# Altium project SFPP.PrjPCB (part 2 of 2)
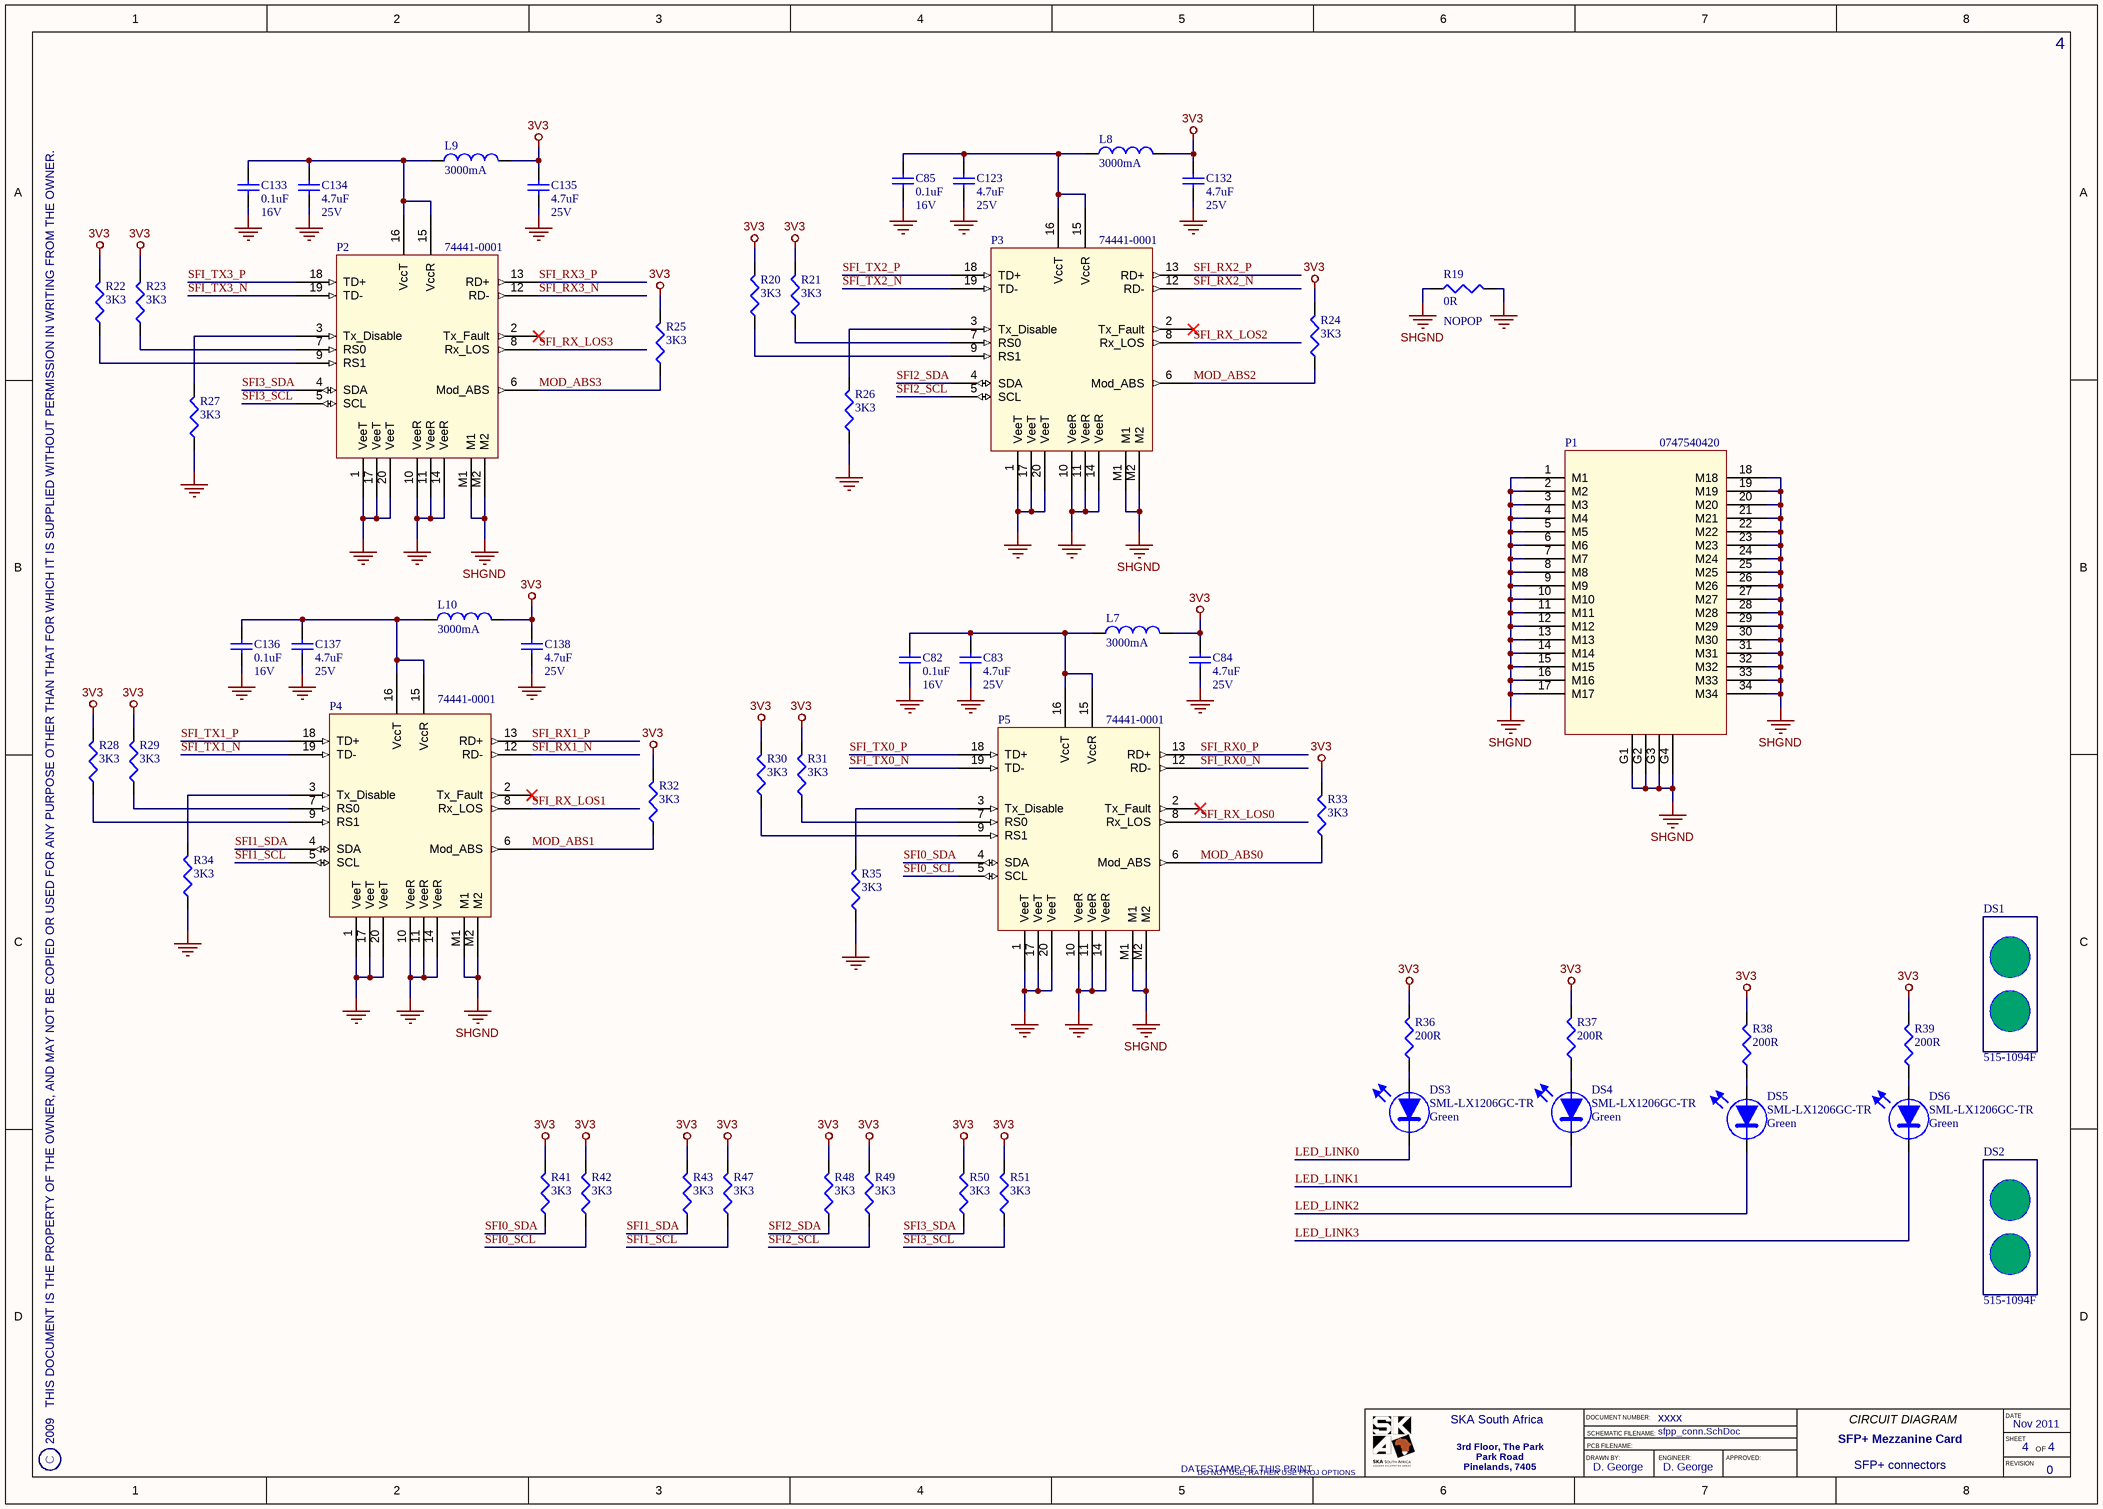
[diagram p4: sfpp_conn.SchDoc]

## Nets that join several sheets
1V2_0: mezzanine (7 pins), phy0 (10 pins)
1V2_1: mezzanine (7 pins), phy1 (10 pins)
1V5: mezzanine (24 pins), phy0 (C60.2 U1.C7), phy1 (C91.2 U2.C7)
1V8: mezzanine (7 pins), phy0 (C47.2 L2.1), phy1 (C94.2 L5.1)
2V5: mezzanine (7 pins), phy1 (C141.2 L11.1 U8.6)
3V3: mezzanine (42 pins), phy0 (7 pins), phy1 (14 pins), sfpp_conn (32 pins)
GND: mezzanine (153 pins), phy0 (122 pins), phy1 (118 pins), sfpp_conn (41 pins)
LED_LINK0: phy0 (U1.D5), sfpp_conn (DS3.1)
LED_LINK1: phy0 (U1.K5), sfpp_conn (DS4.1)
LED_LINK2: phy1 (U2.D5), sfpp_conn (DS5.1)
LED_LINK3: phy1 (U2.K5), sfpp_conn (DS6.1)
MDIO_MODE_EN: mezzanine (J1.C17 R11.2), phy0 (Q4.1)
MGT_RX_N0: mezzanine (J1.A7), phy0 (U1.B3)
MGT_RX_N1: mezzanine (J1.A5), phy0 (U1.B4)
MGT_RX_N2: mezzanine (J1.A3), phy0 (U1.B5)
MGT_RX_N3: mezzanine (J1.A1), phy0 (U1.B6)
MGT_RX_N4: mezzanine (J1.A15), phy0 (U1.L2)
MGT_RX_N5: mezzanine (J1.A13), phy0 (U1.K2)
MGT_RX_N6: mezzanine (J1.A11), phy0 (U1.J2)
MGT_RX_N7: mezzanine (J1.A9), phy0 (U1.H2)
MGT_RX_N8: mezzanine (J1.B7), phy1 (U2.B3)
MGT_RX_N9: mezzanine (J1.B5), phy1 (U2.B4)
MGT_RX_N10: mezzanine (J1.B3), phy1 (U2.B5)
MGT_RX_N11: mezzanine (J1.B1), phy1 (U2.B6)
MGT_RX_N12: mezzanine (J1.B15), phy1 (U2.L2)
MGT_RX_N13: mezzanine (J1.B13), phy1 (U2.K2)
MGT_RX_N14: mezzanine (J1.B11), phy1 (U2.J2)
MGT_RX_N15: mezzanine (J1.B9), phy1 (U2.H2)
MGT_RX_P0: mezzanine (J1.A8), phy0 (U1.A3)
MGT_RX_P1: mezzanine (J1.A6), phy0 (U1.A4)
MGT_RX_P2: mezzanine (J1.A4), phy0 (U1.A5)
MGT_RX_P3: mezzanine (J1.A2), phy0 (U1.A6)
MGT_RX_P4: mezzanine (J1.A16), phy0 (U1.L1)
MGT_RX_P5: mezzanine (J1.A14), phy0 (U1.K1)
MGT_RX_P6: mezzanine (J1.A12), phy0 (U1.J1)
MGT_RX_P7: mezzanine (J1.A10), phy0 (U1.H1)
MGT_RX_P8: mezzanine (J1.B8), phy1 (U2.A3)
MGT_RX_P9: mezzanine (J1.B6), phy1 (U2.A4)
MGT_RX_P10: mezzanine (J1.B4), phy1 (U2.A5)
MGT_RX_P11: mezzanine (J1.B2), phy1 (U2.A6)
MGT_RX_P12: mezzanine (J1.B16), phy1 (U2.L1)
MGT_RX_P13: mezzanine (J1.B14), phy1 (U2.K1)
MGT_RX_P14: mezzanine (J1.B12), phy1 (U2.J1)
MGT_RX_P15: mezzanine (J1.B10), phy1 (U2.H1)
MGT_TX_N0: mezzanine (J1.A23), phy0 (C7.2)
MGT_TX_N1: mezzanine (J1.A21), phy0 (C5.2)
MGT_TX_N2: mezzanine (J1.A19), phy0 (C3.2)
MGT_TX_N3: mezzanine (J1.A17), phy0 (C1.2)
MGT_TX_N4: mezzanine (J1.A31), phy0 (C15.2)
MGT_TX_N5: mezzanine (J1.A29), phy0 (C13.2)
MGT_TX_N6: mezzanine (J1.A27), phy0 (C11.2)
MGT_TX_N7: mezzanine (J1.A25), phy0 (C9.2)
MGT_TX_N8: mezzanine (J1.B23), phy1 (C23.2)
MGT_TX_N9: mezzanine (J1.B21), phy1 (C21.2)
MGT_TX_N10: mezzanine (J1.B19), phy1 (C19.2)
MGT_TX_N11: mezzanine (J1.B17), phy1 (C17.2)
MGT_TX_N12: mezzanine (J1.B31), phy1 (C31.2)
MGT_TX_N13: mezzanine (J1.B29), phy1 (C29.2)
MGT_TX_N14: mezzanine (J1.B27), phy1 (C27.2)
MGT_TX_N15: mezzanine (J1.B25), phy1 (C25.2)
MGT_TX_P0: mezzanine (J1.A24), phy0 (C8.2)
MGT_TX_P1: mezzanine (J1.A22), phy0 (C6.2)
MGT_TX_P2: mezzanine (J1.A20), phy0 (C4.2)
MGT_TX_P3: mezzanine (J1.A18), phy0 (C2.2)
MGT_TX_P4: mezzanine (J1.A32), phy0 (C16.2)
MGT_TX_P5: mezzanine (J1.A30), phy0 (C14.2)
MGT_TX_P6: mezzanine (J1.A28), phy0 (C12.2)
MGT_TX_P7: mezzanine (J1.A26), phy0 (C10.2)
MGT_TX_P8: mezzanine (J1.B24), phy1 (C24.2)
MGT_TX_P9: mezzanine (J1.B22), phy1 (C22.2)
MGT_TX_P10: mezzanine (J1.B20), phy1 (C20.2)
MGT_TX_P11: mezzanine (J1.B18), phy1 (C18.2)
MGT_TX_P12: mezzanine (J1.B32), phy1 (C32.2)
MGT_TX_P13: mezzanine (J1.B30), phy1 (C30.2)
MGT_TX_P14: mezzanine (J1.B28), phy1 (C28.2)
MGT_TX_P15: mezzanine (J1.B26), phy1 (C26.2)
MOD_ABS0: phy0 (U1.D4), sfpp_conn (P5.6 R33.1)
MOD_ABS1: phy0 (U1.L4), sfpp_conn (P4.6 R32.1)
MOD_ABS2: phy1 (U2.D4), sfpp_conn (P3.6 R24.1)
MOD_ABS3: phy1 (U2.L4), sfpp_conn (P2.6 R25.1)
PHY0_RESET: mezzanine (J1.C18 R10.2), phy0 (Q1.1)
PHY0_SCL: mezzanine (P6.5), phy0 (U1.E9 U5.6)
PHY0_SDA: mezzanine (P6.6), phy0 (U1.D9 U5.5)
PHY0_SLV_SCL: mezzanine (P6.14), phy0 (U1.E5)
PHY0_SLV_SDA: mezzanine (P6.13), phy0 (U1.E4)
PHY1_RESET: mezzanine (J1.C19 R9.2), phy1 (Q5.1)
PHY1_SCL: mezzanine (P6.1), phy1 (U2.E9 U7.6)
PHY1_SDA: mezzanine (P6.2), phy1 (U2.D9 U7.5)
PHY1_SLV_SCL: mezzanine (P6.10), phy1 (U2.E5)
PHY1_SLV_SDA: mezzanine (P6.9), phy1 (U2.E4)
PHY_MDC: mezzanine (J1.C20 R7.1), phy0 (U1.D7), phy1 (U2.D7)
PHY_MDIO: mezzanine (J1.C21 R8.1), phy0 (U1.E7), phy1 (U2.E7)
PHY_MODE0: phy0 (Q4.3 R14.1 U1.K11), phy1 (U2.K11)
PHY_MODE1: phy0 (R18.2 U1.M9), phy1 (U2.M9)
PHY_MODE2: phy0 (R15.1 U1.L10), phy1 (U2.L10)
PHY_TRSTn: phy0 (R13.2 U1.K10), phy1 (U2.K10)
SFI0_SCL: phy0 (U1.F5), sfpp_conn (P5.5 R42.1)
SFI0_SDA: phy0 (U1.F4), sfpp_conn (P5.4 R41.1)
SFI1_SCL: phy0 (U1.L6), sfpp_conn (P4.5 R47.1)
SFI1_SDA: phy0 (U1.L5), sfpp_conn (P4.4 R43.1)
SFI2_SCL: phy1 (U2.F5), sfpp_conn (P3.5 R49.1)
SFI2_SDA: phy1 (U2.F4), sfpp_conn (P3.4 R48.1)
SFI3_SCL: phy1 (U2.L6), sfpp_conn (P2.5 R51.1)
SFI3_SDA: phy1 (U2.L5), sfpp_conn (P2.4 R50.1)
SFI_RX0_N: phy0 (U1.B13), sfpp_conn (P5.12)
SFI_RX0_P: phy0 (U1.B14), sfpp_conn (P5.13)
SFI_RX1_N: phy0 (U1.L14), sfpp_conn (P4.12)
SFI_RX1_P: phy0 (U1.L13), sfpp_conn (P4.13)
SFI_RX2_N: phy1 (U2.B13), sfpp_conn (P3.12)
SFI_RX2_P: phy1 (U2.B14), sfpp_conn (P3.13)
SFI_RX3_N: phy1 (U2.L14), sfpp_conn (P2.12)
SFI_RX3_P: phy1 (U2.L13), sfpp_conn (P2.13)
SFI_RX_LOS0: phy0 (U1.D6), sfpp_conn (P5.8)
SFI_RX_LOS1: phy0 (U1.M7), sfpp_conn (P4.8)
SFI_RX_LOS2: phy1 (U2.D6), sfpp_conn (P3.8)
SFI_RX_LOS3: phy1 (U2.M7), sfpp_conn (P2.8)
SFI_TX0_N: phy0 (U1.D14), sfpp_conn (P5.19)
SFI_TX0_P: phy0 (U1.D13), sfpp_conn (P5.18)
SFI_TX1_N: phy0 (U1.N13), sfpp_conn (P4.19)
SFI_TX1_P: phy0 (U1.N14), sfpp_conn (P4.18)
SFI_TX2_N: phy1 (U2.D14), sfpp_conn (P3.19)
SFI_TX2_P: phy1 (U2.D13), sfpp_conn (P3.18)
SFI_TX3_N: phy1 (U2.N13), sfpp_conn (P2.19)
SFI_TX3_P: phy1 (U2.N14), sfpp_conn (P2.18)
XAUI_CLK0_N: phy0 (U1.F14), phy1 (C122.2)
XAUI_CLK0_P: phy0 (U1.F13), phy1 (C81.2)